# Altium schematic sheet Power.SchDoc
size 420 x 297 mm; SheetNumber: 1; SheetTotal: 4
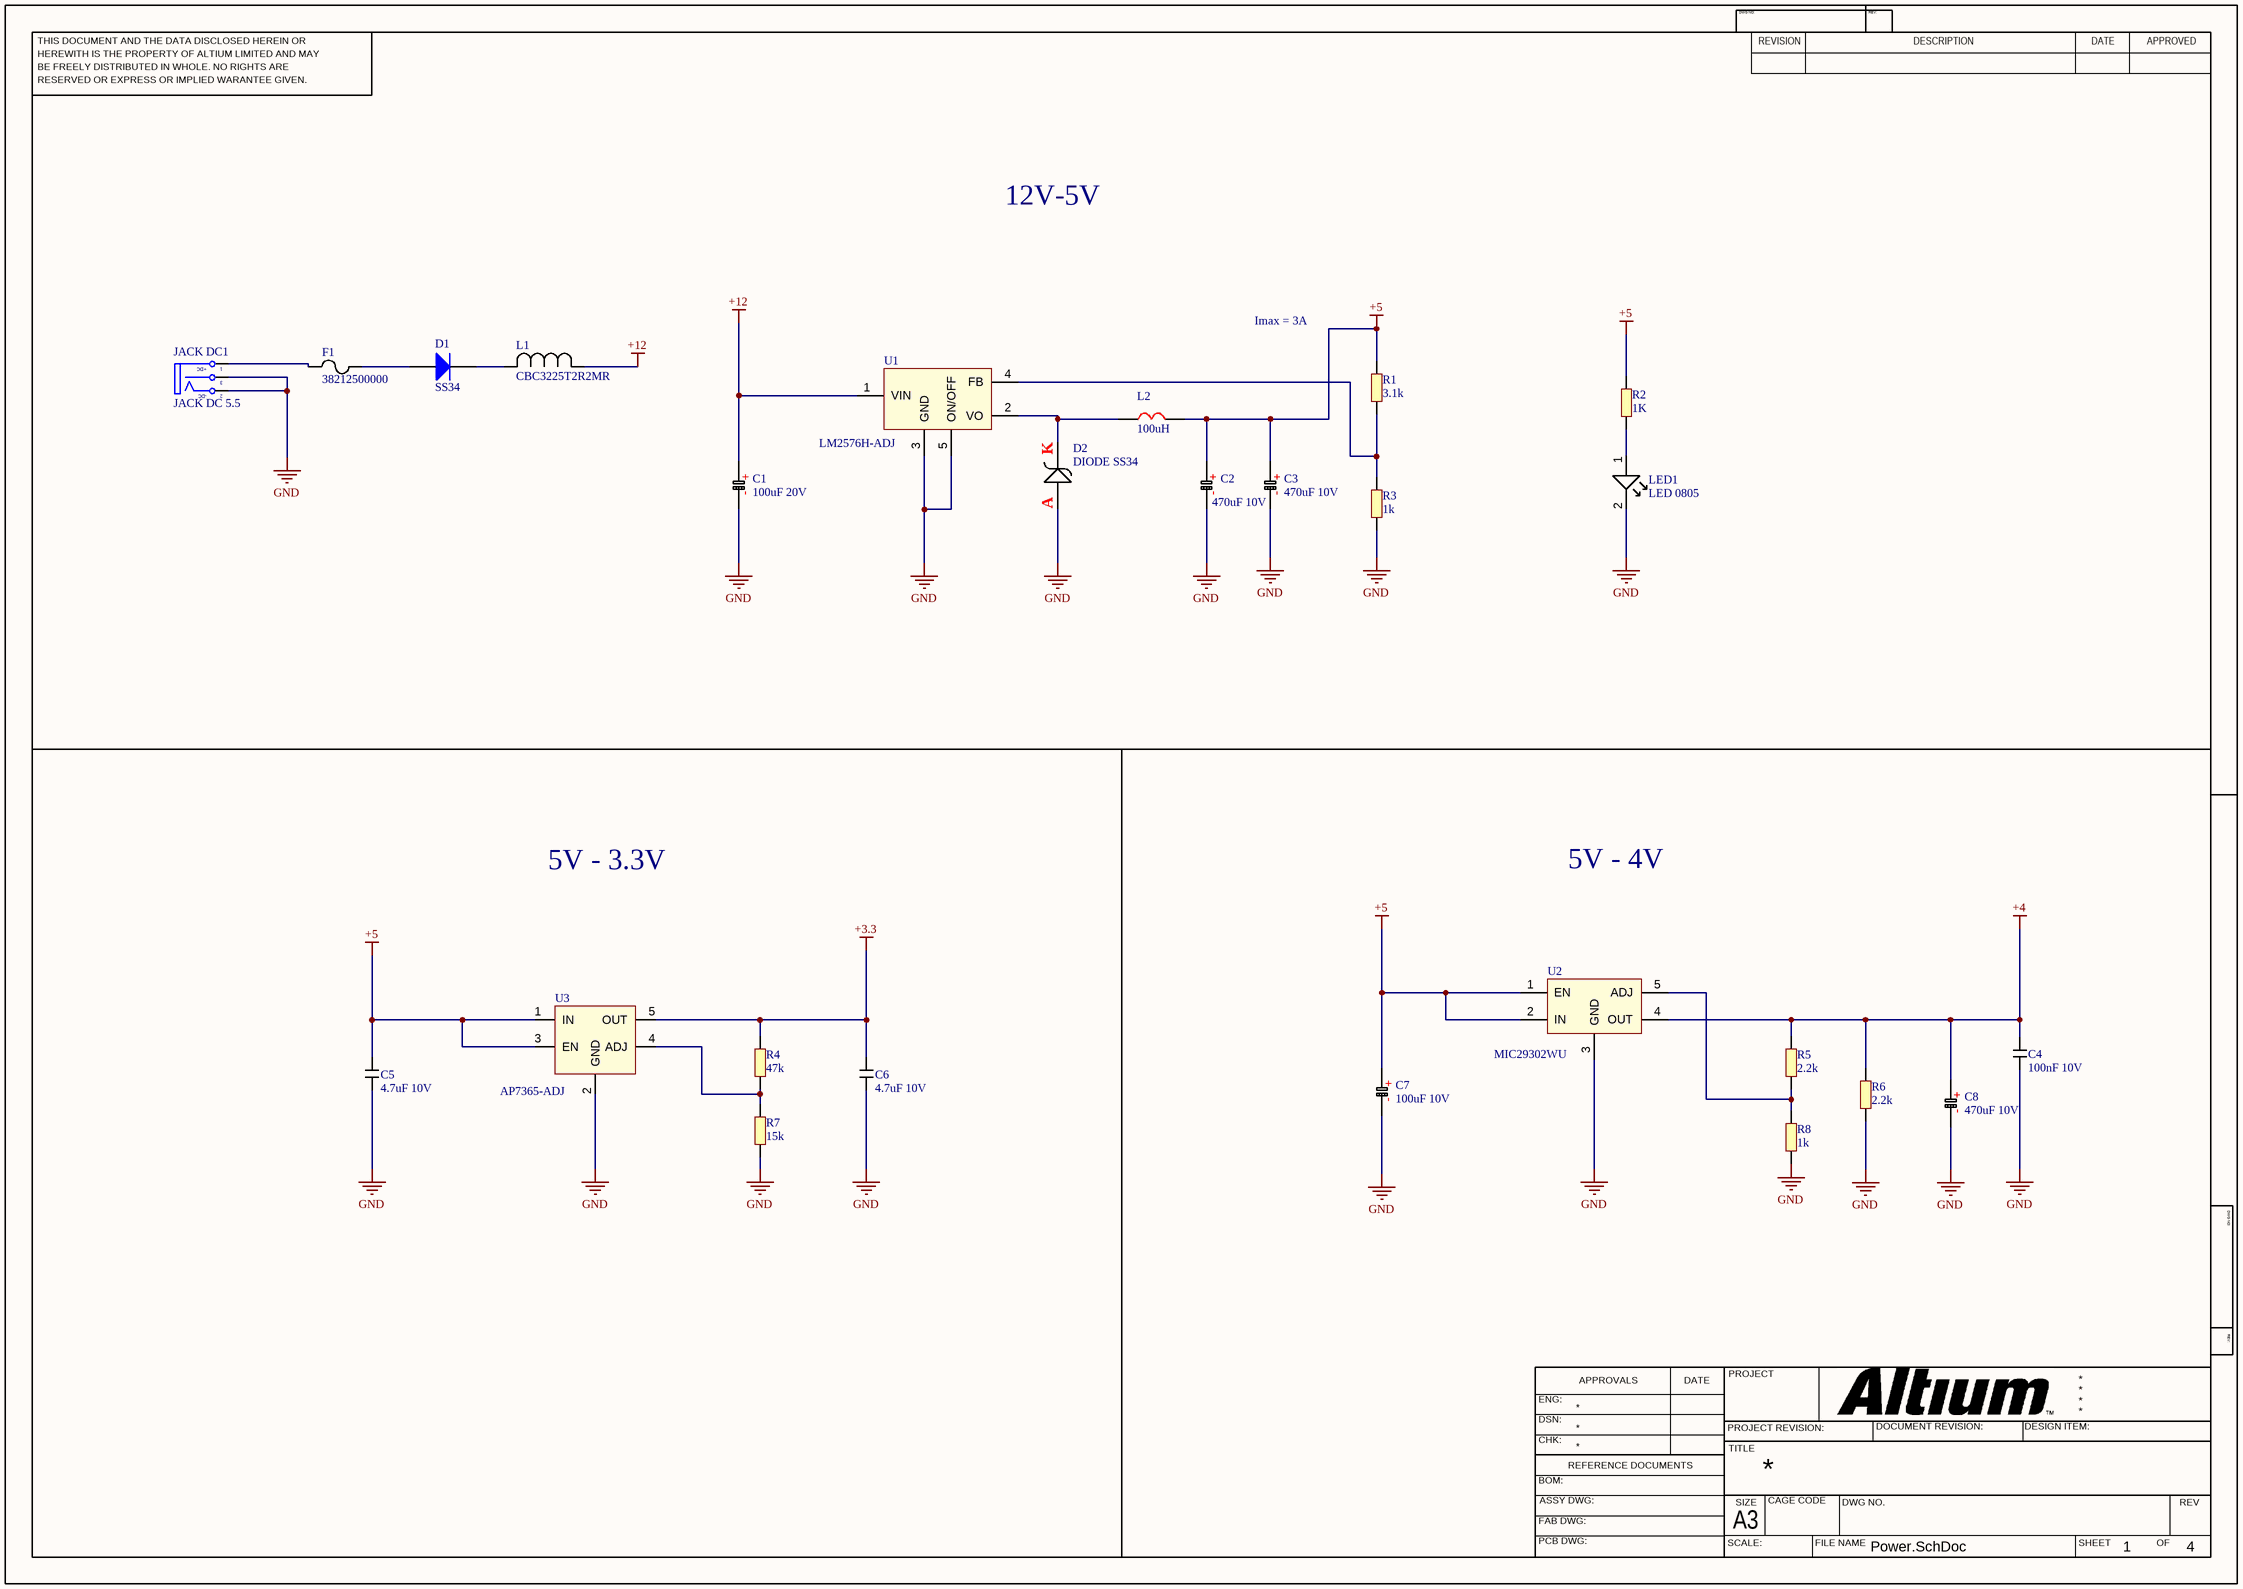
[diagram p0: Power.SchDoc]

## Parts
C1  100uF 20V  [CAPACITOR TALTALIUM 7443]
C2  470uF 10V  [CAPACITOR TALTALIUM 7443]
C3  470uF 10V  [CAPACITOR TALTALIUM 7443]
C4  100nF 10V  [c 0805]
C5  4.7uF 10V  [c 0805]
C6  4.7uF 10V  [c 0805]
C7  100uF 10V  [CAPACITOR TALTALIUM 7443]
C8  470uF 10V  [CAPACITOR TALTALIUM 7443]
D1  SS34  [DIODE SMA]
D2  DIODE SS34  [DIODE SS34]
F1  38212500000  [FUSE_38212500000_LTF]
JACK_DC1  JACK DC 5.5  [JACK DC 5.5]
L1  CBC3225T2R2MR  [IND_TAIYO_CBC3225_TAY]
L2  100uH  [L 4600]
LED1  LED 0805  [LED 0805]
R1  3.1k  [R 0805]
R2  1K  [R 0805]
R3  1k  [R 0805]
R4  47k  [R 0805]
R5  2.2k  [R 0805]
R6  2.2k  [R 0805]
R7  15k  [R 0805]
R8  1k  [R 0805]
U1  LM2576H-ADJ  [LM2576H]
U2  MIC29302WU  [MIC29302WU]
U3  AP7365-ADJ  [AP7365-ADJ]

## Nets
+3.3: C6.2 R4.2 U3.5(OUT)
+4: C4.2 C8.1 R5.2 R6.2 U2.4(OUT)
+5: C2.1 C3.1 C5.2 C7.1 L2.2 R1.2 R2.2 U2.1(EN) U2.2(IN) U3.1(IN) U3.3(EN)
+12: C1.1 L1.1 U1.1(VIN)
GND: C1.2 C2.2 C3.2 C4.1 C5.1 C6.1 C7.2 C8.2 D2.1 JACK_DC1.2(TN) JACK_DC1.3(S) LED1.2 R3.1 R6.1 R7.1 R8.1 U1.3(GND) U1.5(ON/OFF) U2.3(GND) U3.2(GND)
NetD1_1: D1.1(A) F1.2
NetD1_2: D1.2(K) L1.2
NetD2_2: D2.2 L2.1 U1.2(VO)
NetF1_1: F1.1 JACK_DC1.1(T)
NetLED1_1: LED1.1 R2.1
NetR1_1: R1.1 R3.2 U1.4(FB)
NetR4_1: R4.1 R7.2 U3.4(ADJ)
NetR5_1: R5.1 R8.2 U2.5(ADJ)

## Notes on the sheet
- 12V-5V
- Imax = 3A
- 5V - 3.3V
- 5V - 4V
- THIS DOCUMENT AND THE DATA DISCLOSED HEREIN OR
- HEREWITH IS THE PROPERTY OF ALTIUM LIMITED AND MAY
- DWG NO:
- REVISION
- REV:
- DESCRIPTION
- DATE
- APPROVED
- BE FREELY DISTRIBUTED IN WHOLE. NO RIGHTS ARE
- RESERVED OR EXPRESS OR IMPLIED WARANTEE GIVEN.
- ENG:
- APPROVALS
- PROJECT
- DSN:
- CHK:
- REFERENCE DOCUMENTS
- PROJECT REVISION:
- TITLE
- DOCUMENT REVISION:
- DESIGN ITEM:
- BOM:
- FAB DWG:
- PCB DWG:
- ASSY DWG:
- SCALE:
- A3
- SIZE
- CAGE CODE
- FILE NAME
- DWG NO.
- SHEET
- OF
- REV
- (in symbol C Polarize 8x10.2) +; -
- (in symbol DIODE SS34) K; A
- (in symbol JACK DC 5.5) +DC; -DC

## Library data of the parts
C1-C3 C7 C8 = C Polarize 8x10.2
C4-C6 = C 0805
D1 = Diode SS34 ( 1N5822 ): Dán; Don_Vi: Con; Ma_Hang: MH002104; Ten_Linh_Kien: Diode SS34 3A 40V SMA ( 1N5822 SS34A); Kieu_Chan: *; Chung_Loai: Dán
F1 = 38212500000: No Description Available; Mfr_Name: Littelfuse Inc; Type: DEV; Copyright: Copyright (C) 2023 Ultra Librarian. All rights reserved.; Manufacturer_Part_Number: 38212500000; RefDes: RefDes
JACK_DC1 = JACK DC 5.5: Value: Jac DC
L1 = CBC3225T2R2MR: No Description Available; Mfr_Name: Taiyo Yuden; Type: DEV; Copyright: Copyright (C) 2023 Ultra Librarian. All rights reserved.; Manufacturer_Part_Number: CBC3225T2R2MR; RefDes: RefDes
L2 = L 4600
R1-R8 = R 0805
U1 = LM2576H